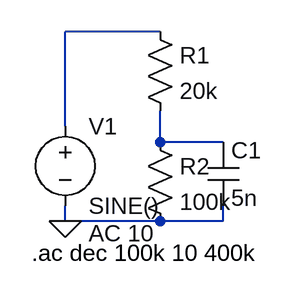
[diagram p0: schematic voltage_devider_LP.asc]
voltage_devider_LP.asc, the LTspice schematic file:
Version 4
SHEET 1 880 680
WIRE 160 64 64 64
WIRE 64 160 64 64
WIRE 160 176 160 144
WIRE 224 176 160 176
WIRE 64 256 64 240
WIRE 160 256 64 256
WIRE 224 256 224 240
WIRE 224 256 160 256
FLAG 64 256 0
SYMBOL res 144 48 R0
SYMATTR InstName R1
SYMATTR Value 20k
SYMBOL res 144 160 R0
SYMATTR InstName R2
SYMATTR Value 100k
SYMBOL cap 208 176 R0
SYMATTR InstName C1
SYMATTR Value 5n
SYMBOL voltage 64 144 R0
WINDOW 123 24 124 Left 2
WINDOW 39 0 0 Left 0
SYMATTR InstName V1
SYMATTR Value SINE()
SYMATTR Value2 AC 10
TEXT 30 288 Left 2 !.ac dec 100k 10 400k

The netlist it stands for:
* voltage_devider_LP.asc
R1 N001 N002 20k
R2 N002 0 100k
C1 N002 0 5n
V1 N001 0 SINE() AC 10
.ac dec 100k 10 400k
.backanno
.end